# Altium schematic sheet regulator.SchDoc
size A; SheetNumber: 1; SheetTotal: 3
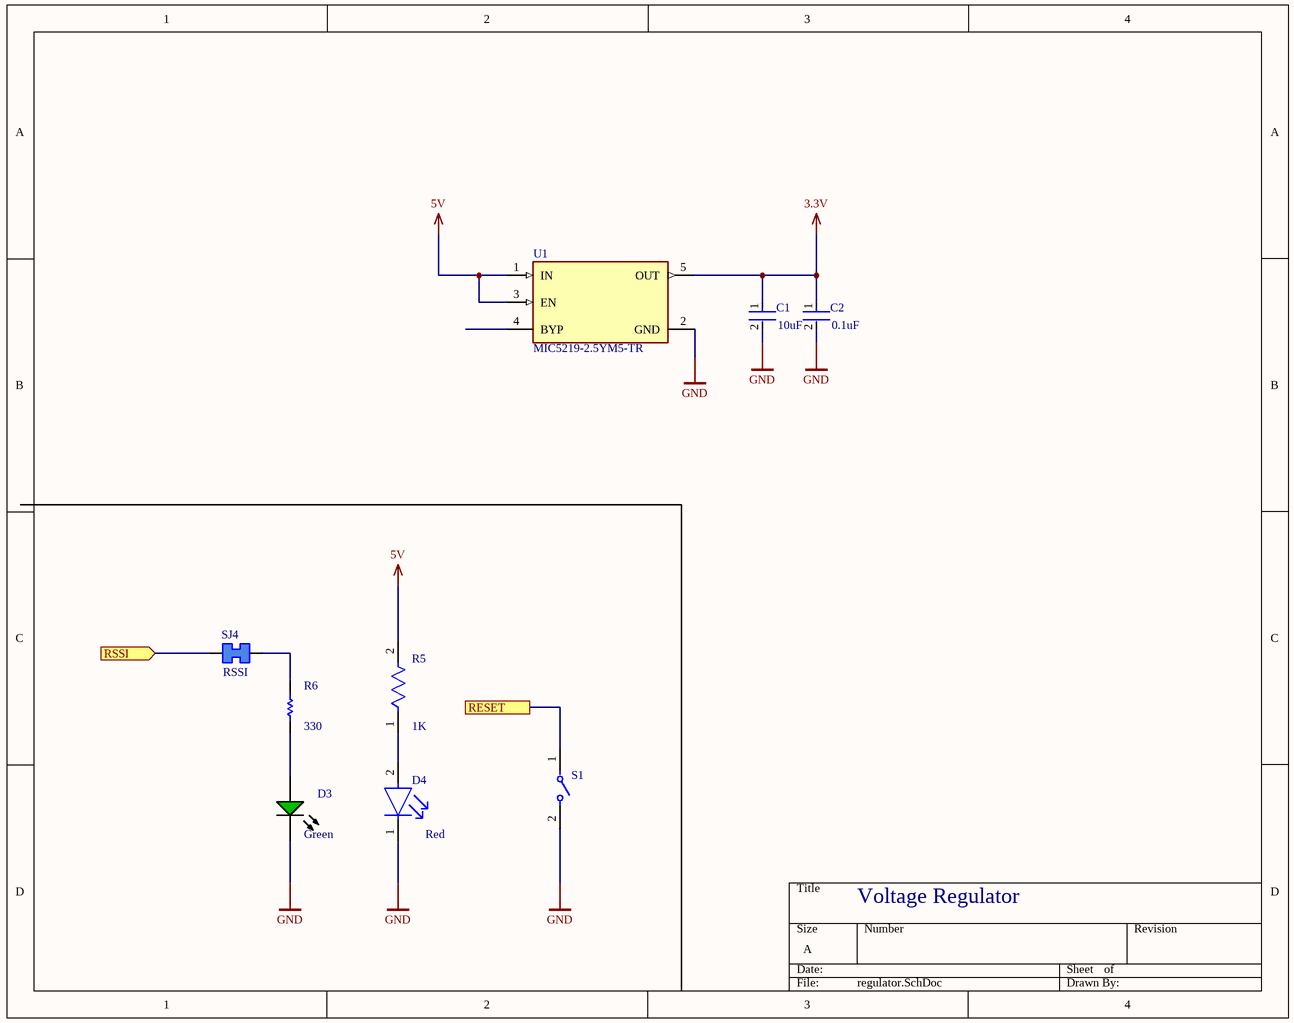
[diagram p0: regulator.SchDoc]

## Parts
C1  10uF  [FP-GRM188-0_1-e0_2_0_55-IPC_A]
C2  0.1uF  [FP-C0402-BB-MFG]
D3  Green  [AVAG-HSMX-C170_V]
D4  Red  [FP-HSMS-C150-MFG]
R5  1K  [FP-ERJ1GN-IPC_C]
R6  330  [RESC0603X26X15ML03T05]
S1  (no value)  [FP-B3F-6022-MFG]
SJ4  RSSI  [Solder Jumper-Footprint-1]
U1  MIC5219-2.5YM5-TR  [FP-SOT23-5LD-PL-1-MFG]

## Ports
RESET, RSSI (in)

## Nets
3.3V: C1.1 C2.1 U1.5(OUT)
5V: R5.2 U1.1(IN) U1.3(EN)
GND: C1.2 C2.2 D3.2(K) D4.1(C) S1.2 U1.2(GND)
RESET: S1.1 ; port RESET
RSSI: SJ4.1 ; port RSSI
NetD3_1: D3.1(A) R6.2
NetD4_2: D4.2(A) R5.1
NetR6_1: R6.1 SJ4.2

Not connected (* = marked no-connect by the designer): U1 4(BYP)

## Notes on the sheet
- Voltage Regulator

## Library data of the parts
C1 = CMP-2006-02792-2: Chip Multilayer Ceramic Capacitors for General Purpose, 0603, 10uF, X5R, 15%, 20%, 6.3V; Packaging: Tape and Reel; Voltage Rating (DC): 6.3V; Width: 0.031inch; Termination: SMD/SMT; Dielectric: X5R; Package Quantity: 4000; Voltage Rating: 6.3V; Capacitance: 10uF; Case/Package: 0603; Min Operating Temperature: -55°C; Voltage: 6.3V; Length: 1.6mm; Thickness: 0.035inch; Lead Free: Lead Free; Depth: 0.8mm; Case Code (Imperial): 0603; Max Operating Temperature: 85°C; Material: Ceramic; Height: 0.8mm; Tolerance: 20%; Mount: Surface Mount; REACH SVHC: No SVHC; Radiation Hardening: No; Case Code (Metric): 1608
C2 = CMP-2008-02046-2: CAP CER 0.1UF 10V X5R 0402; Manufacturer: Kemet; Manufacturer Part Number: C0402C104K8PACTU; Material: Ceramic; Capacitance: 0.10 μF; Temperature Coefficient: 15%; Tolerance: 0.1; Value: 0.10 μF; Package: C0402-BB; Temperature: -55°C to +125°C; ComponentLink2Description: Datasheet; Temperature Characteristic: X5R; Device Class L1: Passive Components; Height: 0.55mm; Lead Free: Yes; ComponentLink2URL: https://content.kemet.com/datasheets/KEM_C1002_X7R_SMD.pdf; Device Class L2: Capacitors; Temperature Range Low: -55°C; Temperature Range High: +125°C; RoHS: TRUE; Octopart: https://octopart.com/c0402c104k8pactu-kemet-140039; Automotive: No; Mouser Description: Capacitor 100 nF 10 VDC 0402; Category: Cap; Voltage Rating: 10 V; Digikey Description: CAP CER 0.1UF 10V X5R 0402; Ipc Land Pattern Name: CAPC10050X50; Device Class L3: Ceramic Capacitors
D3 = CMP-2000-05062-1: Chip LED, Green, 2.2 V, -40 to 85 degC, 2-Pin SMD, Pb-Free, Tape and Reel; Manufacturer: Avago; No. of Pins: 2; Peak Wavelength: 570nm; SVHC: NoSVHC(16-Jun-2014); Dominant Wavelength: 572nm; Forward Current If: 20mA; Viewing Angle: 170deg; Lens Shape: Rectangular; PIV Max: 5V; External Width: 1.25mm; LED Type: Standard; External Depth: 0.8mm; Opto Mounting Orientation: Top; Luminous Intensity: 15mcd; Luminous Intensity Min: 4mcd; Forward Voltage VF Max: 2.6V; External Length / Height: 2mm; Bulb Size: 1.25mmx1.4mm; Light Area Height: 1mm; Voltage Vf Typ: 2.2V; Operating Temperature Max: 85degC; Datasheet Version: Oct-08; MSL: MSL2A-4weeks; Peak Forward Current: 20mA; Package Description: 2-Pin Surface Mount Device, Body 2 x 1.25 mm, Height 0.8 mm; Datasheet URL: https://datasheet.ciiva.com/29280/180495-da-01-en-chip-led-hsmg-c170-gelb-gruen-29280971.pdf; Storage Temperature Min: -40degC; LED Colour: Green; Wavelength Typ: 570nm; Mounting Type: SMD; Forward Current If Max: 20mA; Dominant Wavelength Typ: 572nm; LED Mounting: SMD; Operating Temperature Range: -30degCto+85degC; Operating Temperature Min: -30degC; Manufacturer URL: http://www.avagotech.com/; Packaging: CutTape; Luminous Intensity Typ: 15mcd; Package Reference: HSMX-C170; Storage Temperature Max: 85degC; Opto Case Style: SMD; Forward Voltage: 2.2V
D4 = CMP-21615-000001-1: LED RED DIFFUSED CHIP SMD; Luminous Intensity: 10mcd; Power Dissipation: 65mW; Viewing Angle: 170°; Number of Elements: 1; Forward Current: 20mA; Lens Color: White; Lens Style: Rectangular; Wavelength: 626nm; Forward Voltage: 2.1V; Reverse Voltage: 5V; Number of Pins: 2; Color: Red; Lead Free: Lead Free; Width: 1.6mm; Length: 3.2mm; REACH SVHC: No SVHC; Height: 1.1mm; Depth: 1.6mm; Power Rating: 65mW; Package Quantity: 1; Illumination Color: Red; Radiation Hardening: No; Case Code (Imperial): 1206; Max Operating Temperature: 85°C; Test Current: 20mA; Case/Package: 1206; Lens Transparency: Diffused; Number of LEDs: 1; Packaging: Tape and Reel; Mount: Surface Mount; Min Operating Temperature: -40°C; Case Code (Metric): 3216; Dominant Wavelength: 626nm
R5 = CMP-1010-00416-3: RES SMD 1K OHM 1% 1/20W 0201; Temperature Coefficient: 200ppm/°C; Max Power Dissipation: 50mW; Voltage Rating (DC): 25V; Resistance: 1kR; Number of Pins: 2; Height: 0.01inch; Weight: 6E-06oz; Min Operating Temperature: -55°C; Features: Automotive AEC-Q200; Radiation Hardening: No; Resistor Type: Thick Film; RoHS Compliant: Yes; Termination: SMD/SMT; Package Quantity: 15000; Size Code: 0201; Case Code (Imperial): 0201; Resistance Tolerance: 1%; Contact Plating: Tin; Case/Package: 0201; Lead Free: Lead Free; Number of Terminations: 2; Tolerance: 1%; Max Operating Temperature: 125°C; Mount: Surface Mount; Width: 0.012inch; Series: ERJ; Voltage Rating: 25V; Power Rating: 50mW; Packaging: Tape and Reel; Length: 0.6mm; Case Code (Metric): 0603
R6 = CMP-2004-03502-1: Part Number: ERJ1GNF3300C; Manufacturer: Panasonic
S1 = CMP-08834-000012-1: SWITCH TACTILE SPST-NO 0.05A 24V; Switch Travel: 0.25mm; Actuator Type: Standard; Mechanical Life: 300000Cycles; Switch Function: Off-Mom; Illumination Type: Non-Illuminated; Operating Force: 1.47N; Throw Configuration: SPST; Case/Package: Radial; Contact Plating: Gold; Termination: PC Pins; Max Voltage Rating (DC): 24V; Packaging: Ammo Pack; Min Operating Temperature: -25°C; Mount: Through Hole; Package Quantity: 1000; Max Operating Temperature: 70°C
SJ4 = CMP-00030-00001-2: 2 pad Solder Jumper
U1 = CMP-00252-66802246-1: MIC5219-2.5YM5-TR LDO Regulator Pos 2.5V 0.5A 5-Pin SOT-23 T/R; Max Junction Temperature (Tj): 125°C; Dropout Voltage: 350mV; Output Type: Fixed; Accuracy: 1%; Number of Regulators: 1; Max Input Voltage: 12V; Output Current: 500mA; Min Supply Voltage: 3.5V; Polarity: Positive; Packaging: Tape and Reel; Height: 1.1mm; RoHS: Compliant; NexarPartId: 66802246; Number of Pins: 5; Lifecycle Status: Production; Lead Free: Lead Free; Output Voltage Accuracy: 1%; Schedule B: 8542390000; Case/Package: SOT-23; Output Voltage: 2.5V; REACH SVHC: No SVHC; Max Operating Temperature: 125°C; Mount: Surface Mount; Width: 1.6mm; Nominal Output Voltage: 2.5V; Min Input Voltage: 2.5V; Length: 2.9mm; Min Output Voltage: 2.5V; Max Supply Voltage: 12V; Ambient Temperature Range High: 125°C; Number of Outputs: 1; Min Operating Temperature: -40°C; Max Output Current: 500mA